# EasyEDA Pro project ProProject_扫描隧道显微镜OpenSTM_2023-08-25.epro, schematic ScannerConnector
Create Date: 2022-03-07; Page Name: P1; Project Name: STM-New-Structure; Schematic Name: PeizoConnector; Update Date: 2022-07-22; Add into BOM: yes; Convert to PCB: yes
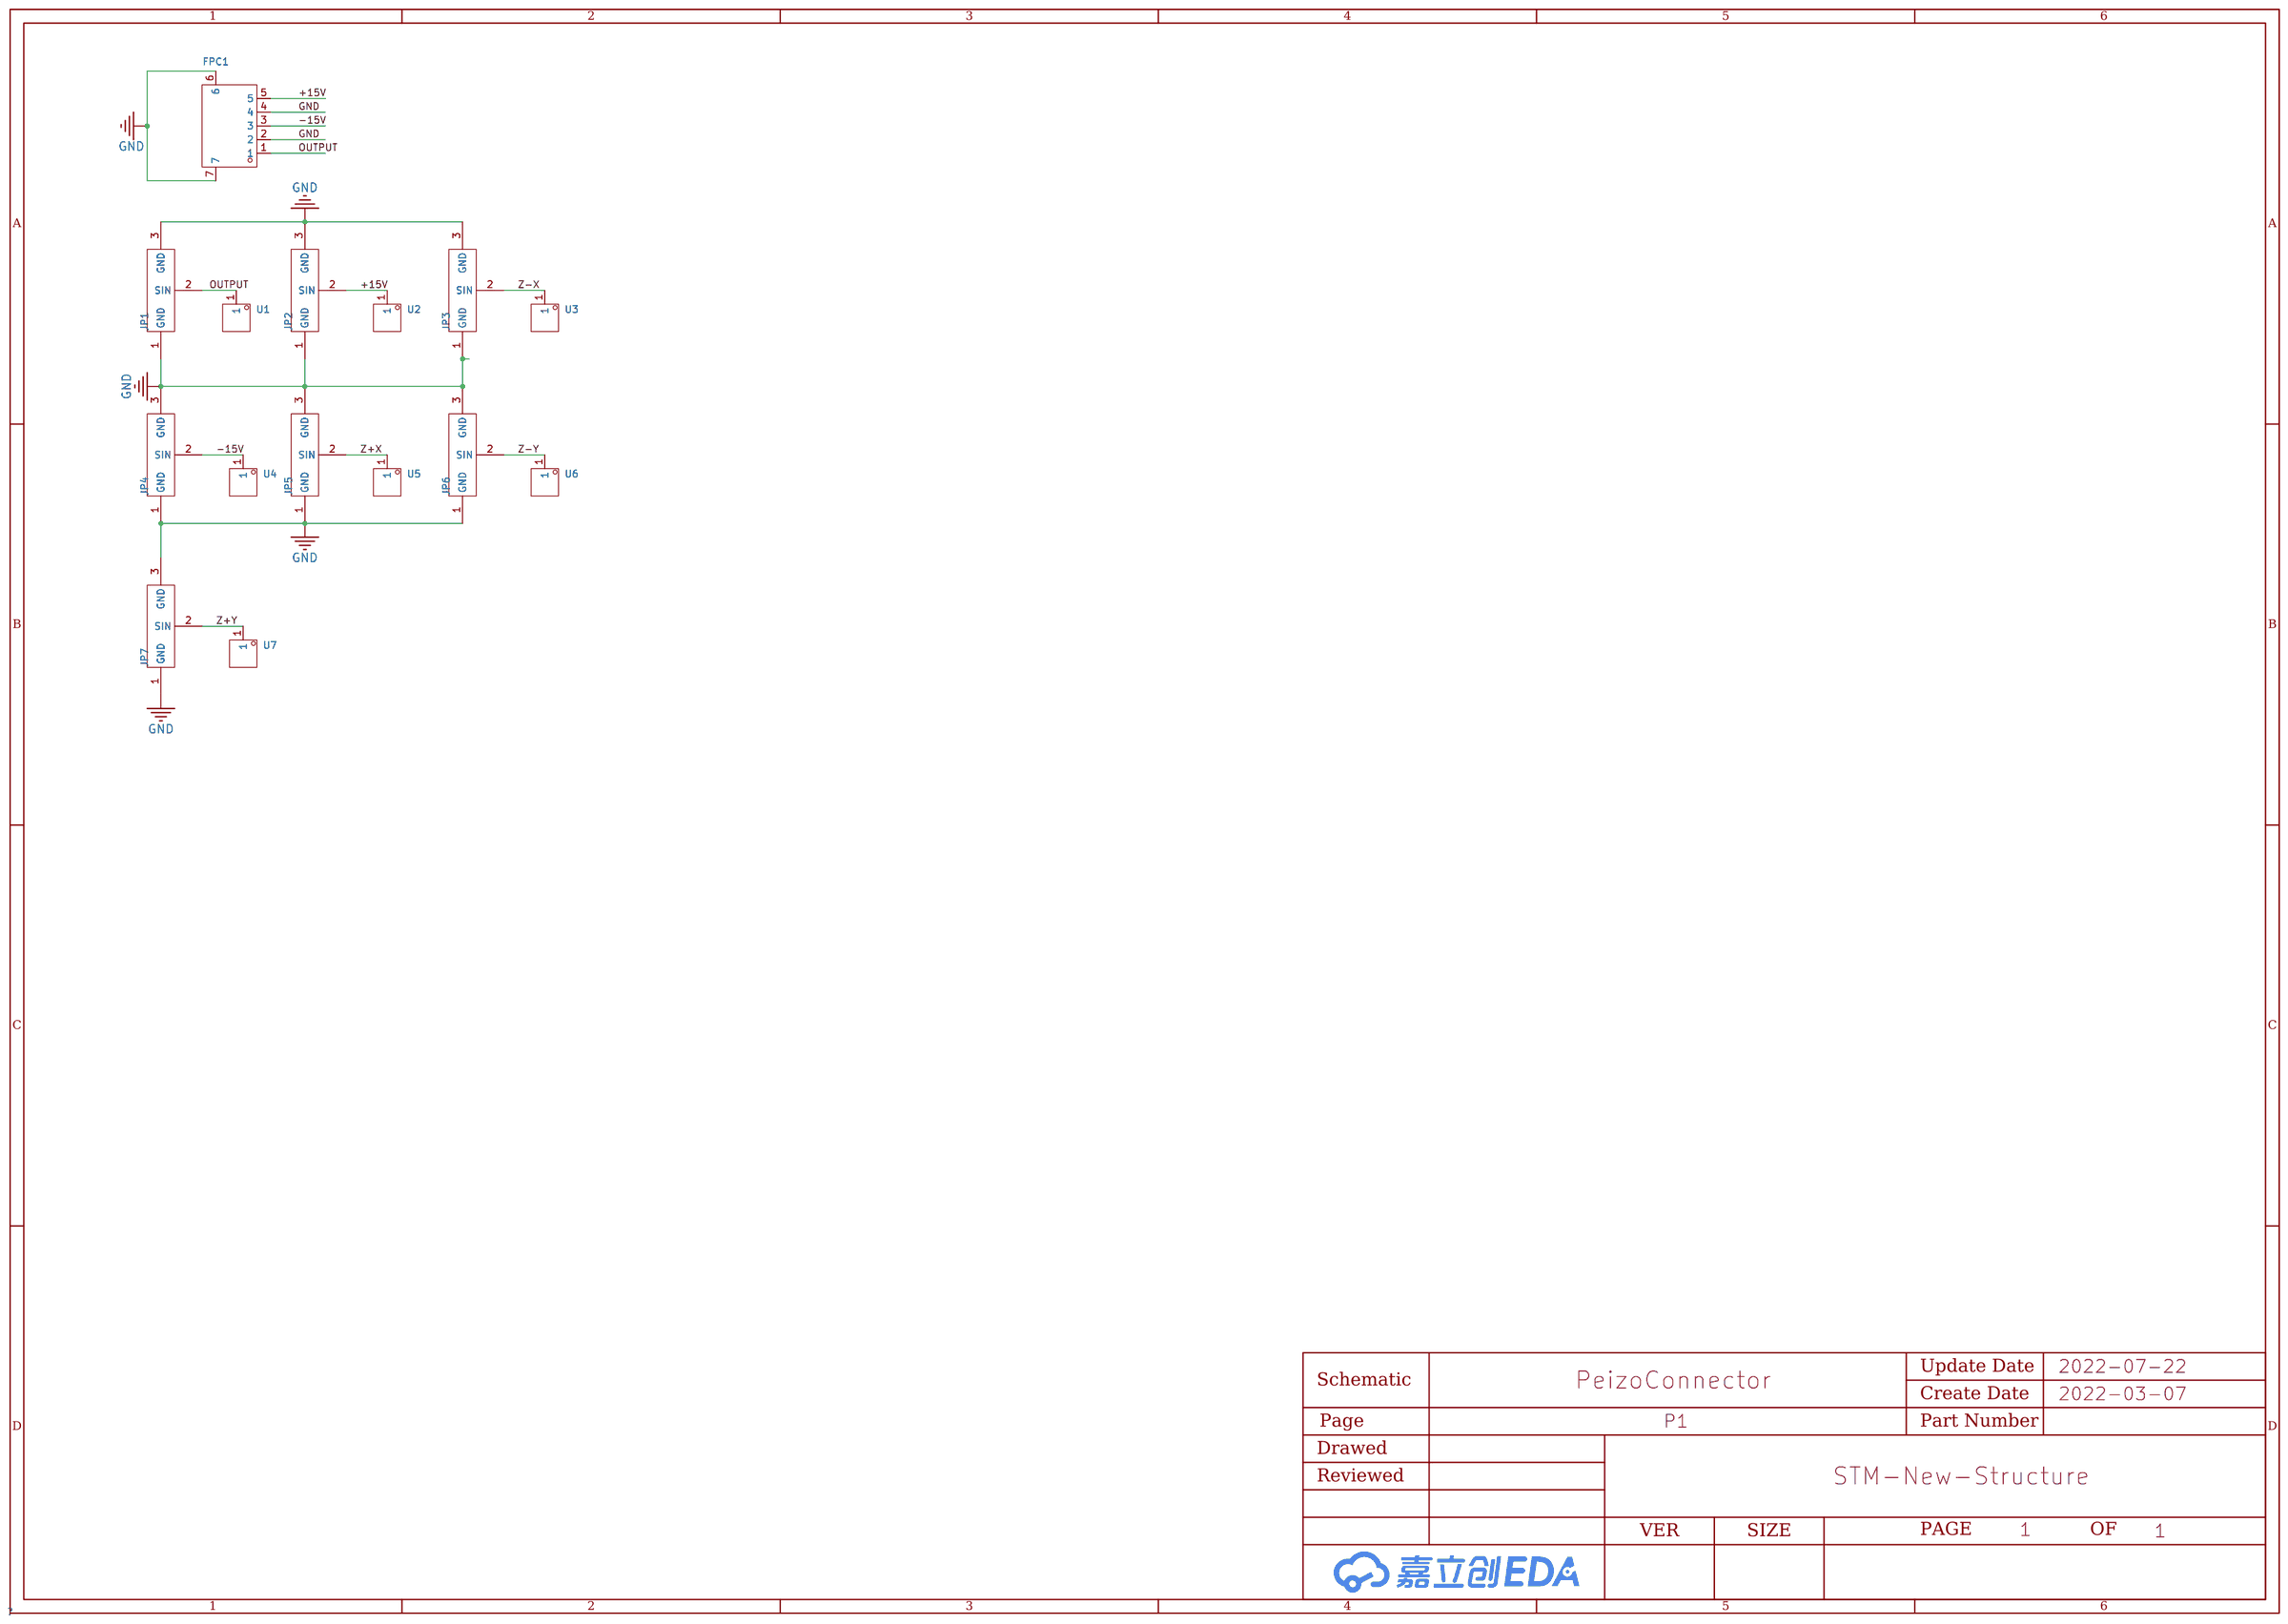
[diagram p6: schematic sheet]

## Parts
FPC1  -  [FPC-SMD_5P-P0.50_THD0510-05CL-GF]
JP1  -  [ANT-SMD_UFL-R-SMT-1-10]
JP2  -  [ANT-SMD_UFL-R-SMT-1-10]
JP3  -  [ANT-SMD_UFL-R-SMT-1-10]
JP4  -  [ANT-SMD_UFL-R-SMT-1-10]
JP5  -  [ANT-SMD_UFL-R-SMT-1-10]
JP6  -  [ANT-SMD_UFL-R-SMT-1-10]
JP7  -  [ANT-SMD_UFL-R-SMT-1-10]
U1  -  [TEST-SMD_L2.7-W1.0]
U2  -  [TEST-SMD_L2.7-W1.0]
U3  -  [TEST-SMD_L2.7-W1.0]
U4  -  [TEST-SMD_L2.7-W1.0]
U5  -  [TEST-SMD_L2.7-W1.0]
U6  -  [TEST-SMD_L2.7-W1.0]
U7  -  [TEST-SMD_L2.7-W1.0]

## Library data of the parts
FPC1 = THD0510-05CL-GF: 间距:0.5mm;触点数量:5;锁定特性:翻盖式;安装类型:卧贴;触点类型:下接;; LCSC Part Name: 0.5mm P数:5 翻盖式 下接; Supplier Part: C283117; Manufacturer: THD(台华达); Supplier Footprint: SMD,P=0.5mm; JLCPCB Part Class: Extended Part; Datasheet: https://atta.szlcsc.com/upload/public/pdf/source/20181023/C283117_FD142D424EBF2D5652708496952DDE0A.pdf; Supplier: LCSC; Pitch: 0.5mm; Number of Contacts: 5; Locking Feature: 翻盖式; Mounting Type: 卧贴; Contact Type: 下接; Height Above Board: 1mm; FFC, FCB Thickness: 0.3mm
JP1-JP7 = U.FL-R-SMT-1(10): 连接器类型:板端;射频系列:IPEX;接口类型:内针;端口数量:1;阻抗:50;频率-最大值:6GHz;样式:-;接口直径:2mm;接口长度/高度:1.25mm;工作温度范围:-40~+90;; LCSC Part Name: IPEX 内针; Supplier Part: C88373; Manufacturer: HRS(广濑); Supplier Footprint: SMD; JLCPCB Part Class: Extended Part; Datasheet: https://atta.szlcsc.com/upload/public/pdf/source/20170116/1484561244841.pdf; Supplier: LCSC; Connector Type: 板端; RF Series: IPEX; Interface Type: 内针; Number of Ports: 1; Impedance: 50; Frequency-Max: 6GHz; Interface Diameter: 2mm; Interface Length/Height: 1.25mm; Operating Temperature Range: -40~+90
U1-U7 = 5017: 连接器类型:测试点/测试环;颜色:-;; LCSC Part Name: 测试点/测试环; Supplier Part: C238130; Manufacturer: Keystone; JLCPCB Part Class: Extended Part; Datasheet: https://atta.szlcsc.com/upload/public/pdf/source/20180629/C238130_5A26801579F58754781F264880A43AC8.PDF; Supplier: LCSC; Connector Type: 测试点/测试环

## Nets
+15V: FPC1.5 JP2.2(SIN) U2.1
-15V: FPC1.3 JP4.2(SIN) U4.1
GND: FPC1.2 FPC1.4 FPC1.6 FPC1.7 JP1.1(GND) JP1.3(GND) JP2.1(GND) JP2.3(GND) JP3.1(GND) JP3.3(GND) JP4.1(GND) JP4.3(GND) JP5.1(GND) JP5.3(GND) JP6.1(GND) JP6.3(GND) JP7.1(GND) JP7.3(GND)
OUTPUT: FPC1.1 JP1.2(SIN) U1.1
Z+X: JP5.2(SIN) U5.1
Z+Y: JP7.2(SIN) U7.1
Z-X: JP3.2(SIN) U3.1
Z-Y: JP6.2(SIN) U6.1
